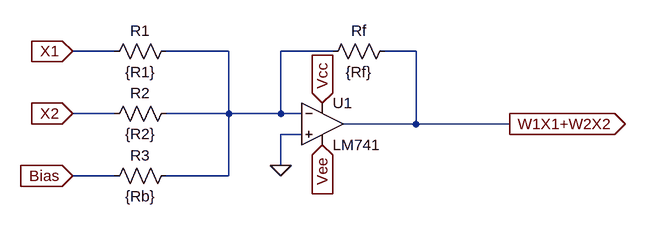
[diagram p0: schematic Weight_Adder.asc]
Weight_Adder.asc, the LTspice schematic file:
Version 4.1
SHEET 1 888 680
WIRE 64 80 0 80
WIRE 240 80 144 80
WIRE 400 80 320 80
WIRE 528 80 480 80
WIRE 64 176 0 176
WIRE 240 176 240 80
WIRE 240 176 144 176
WIRE 320 176 320 80
WIRE 320 176 240 176
WIRE 352 176 320 176
WIRE 528 192 528 80
WIRE 528 192 416 192
WIRE 672 192 528 192
WIRE 352 208 320 208
WIRE 320 256 320 208
WIRE 64 272 0 272
WIRE 240 272 240 176
WIRE 240 272 144 272
FLAG 0 80 X1
IOPIN 0 80 In
FLAG 0 176 X2
IOPIN 0 176 In
FLAG 0 272 Bias
IOPIN 0 272 In
FLAG 672 192 W1X1+W2X2
IOPIN 672 192 Out
FLAG 320 256 0
FLAG 384 160 Vcc
IOPIN 384 160 In
FLAG 384 224 Vee
IOPIN 384 224 In
SYMBOL res 160 64 R90
WINDOW 0 0 56 VBottom 2
WINDOW 3 32 56 VTop 2
SYMATTR InstName R1
SYMATTR Value {R1}
SYMBOL res 160 160 R90
WINDOW 0 0 56 VBottom 2
WINDOW 3 32 56 VTop 2
SYMATTR InstName R2
SYMATTR Value {R2}
SYMBOL res 160 256 R90
WINDOW 0 0 56 VBottom 2
WINDOW 3 32 56 VTop 2
SYMATTR InstName R3
SYMATTR Value {Rb}
SYMBOL res 496 64 R90
WINDOW 0 0 56 VBottom 2
WINDOW 3 32 56 VTop 2
SYMATTR InstName Rf
SYMATTR Value {Rf}
SYMBOL LM741 384 128 R0
SYMATTR InstName U1

The netlist it stands for:
* Weight_Adder.asc
R1 N001 X1 {R1}
R2 N001 X2 {R2}
R3 N001 Bias {Rb}
Rf W1X1+W2X2 N001 {Rf}
X§U1 0 N001 Vcc Vee W1X1+W2X2 LM741  ; pins In+ In- V+ V- OUT
.lib LM741.lib
.backanno
.end